# EAGLE design SparkFun WiFi Shield - DA16200 (EAGLE 9.6.2)
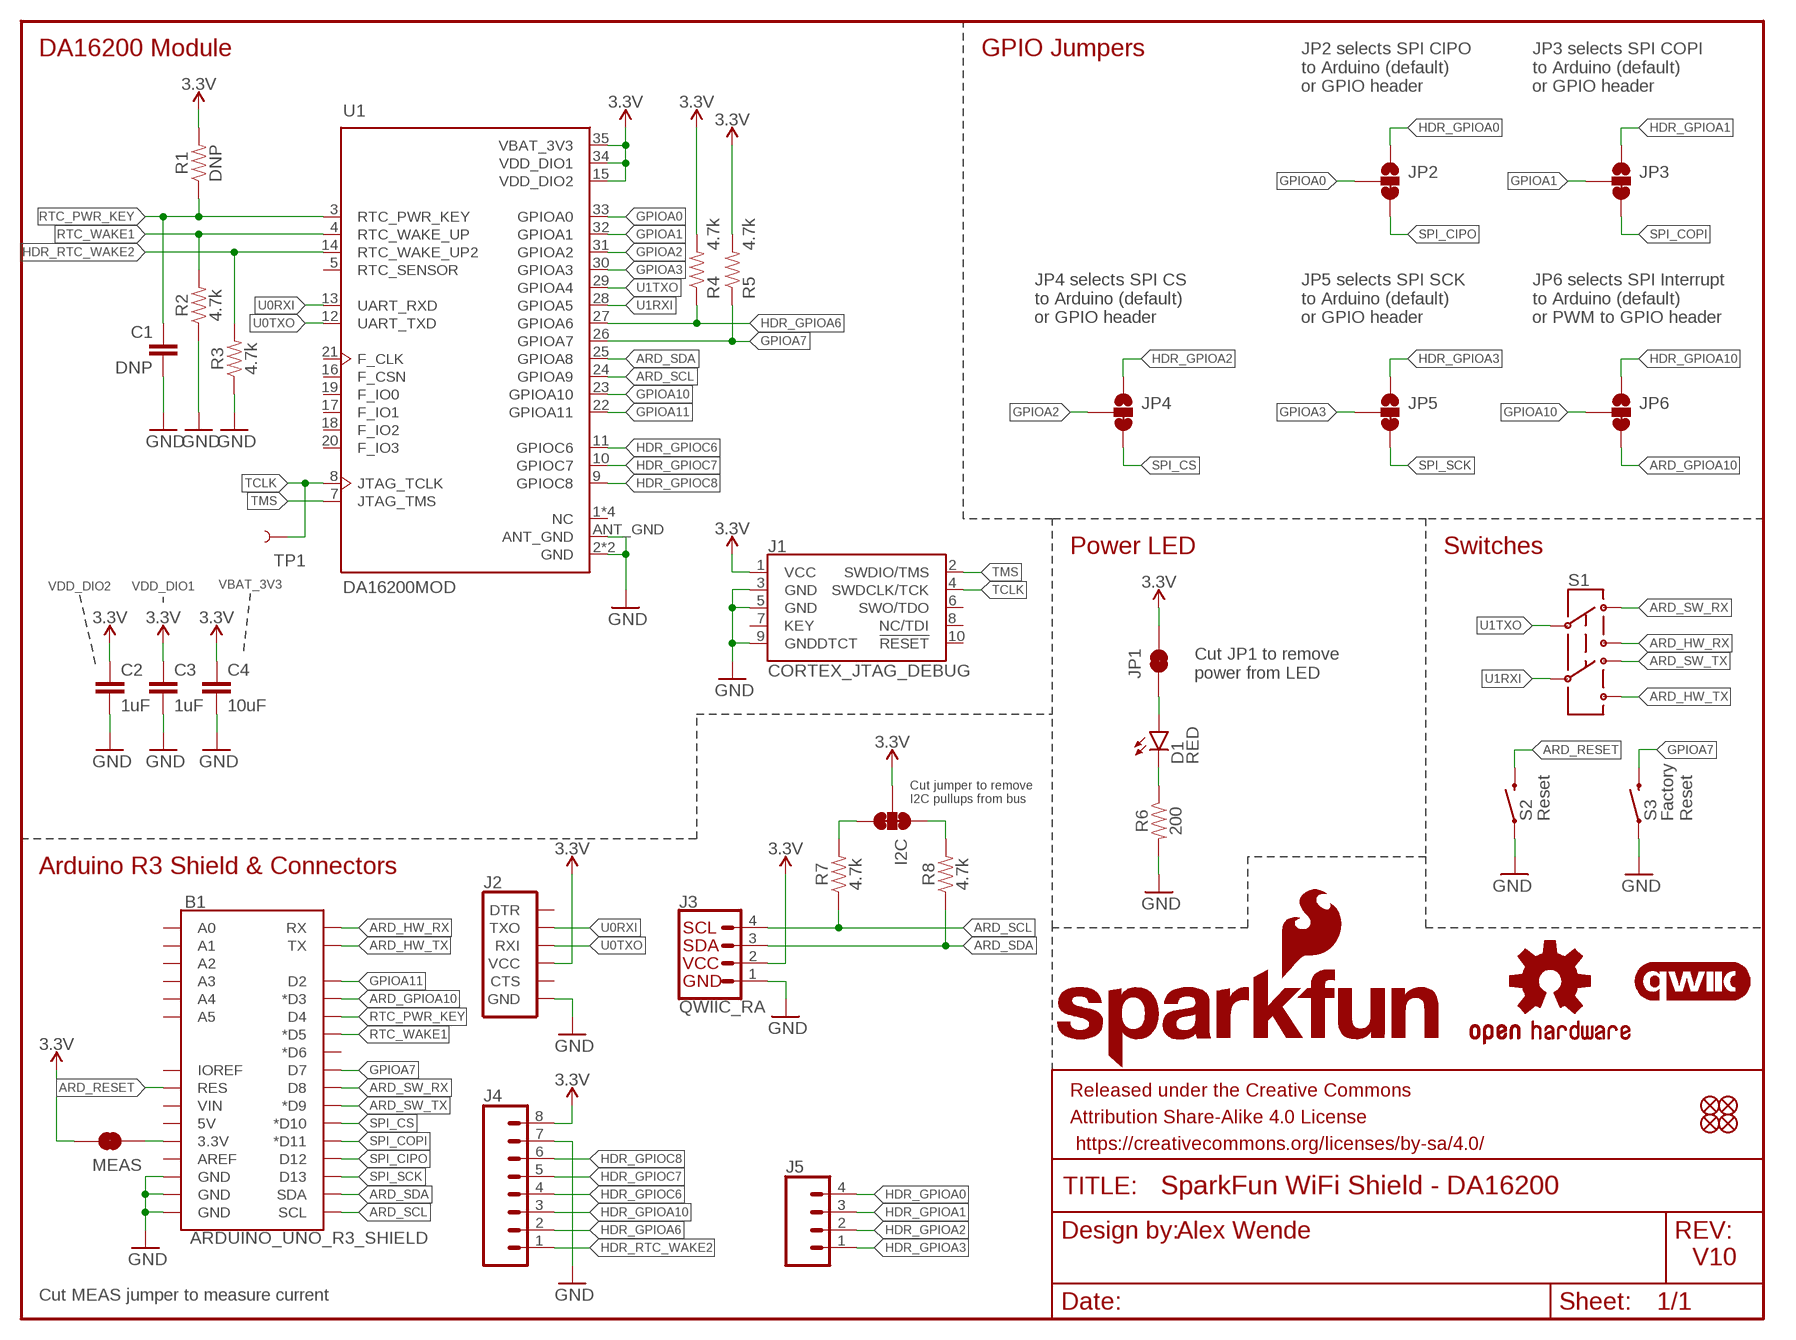
[diagram p0: schematic, sheet 1]

## Parts
B1  ARDUINO_UNO_R3_SHIELD  ARDUINO_UNO_R3_SHIELDUNO_R3_SHIELD_NOLABELS_LOCK  [UNO_R3_SHIELD_NOLABELS_LOCK]
C1  DNP  CAP-0603  [0603]
C2  1uF  1.0UF-0603-16V-10%  [0603]
C3  1uF  1.0UF-0603-16V-10%  [0603]
C4  10uF  10UF-0603-6.3V-20%  [0603]
D1  RED  LED-RED0603  [LED-0603]
FD1  FIDUCIAL1X2  [FIDUCIAL-1X2]
FD2  FIDUCIAL1X2  [FIDUCIAL-1X2]
FD3  FIDUCIAL1X2  [FIDUCIAL-1X2]
FD4  FIDUCIAL1X2  [FIDUCIAL-1X2]
FRAME1  FRAME-LETTER  [CREATIVE_COMMONS]
I2C  JUMPER-SMT_3_2-NC_TRACE_SILK  [SMT-JUMPER_3_2-NC_TRACE_SILK]
J1  CORTEX_JTAG_DEBUG  CORTEX_JTAG_DEBUG_PTH_NS  [2X5-PTH-1.27MM-NO_SILK]
J2  6_PIN_SERIAL_TARGET_NO_SILK  [1X06_NO_SILK]
J3  QWIIC_RA  QWIIC_CONNECTORJS-1MM  [JST04_1MM_RA]
J4  CONN_08NO_SILK_DNP  [1X08_NO_SILK]
J5  CONN_041X04_NO_SILK  [1X04_NO_SILK]
JP1  JUMPER-SMT_2_NC_TRACE_SILK  [SMT-JUMPER_2_NC_TRACE_SILK]
JP2  JUMPER-SMT_3_1-NC_TRACE_SILK  [SMT-JUMPER_3_1-NC_TRACE_SILK]
JP3  JUMPER-SMT_3_1-NC_TRACE_SILK  [SMT-JUMPER_3_1-NC_TRACE_SILK]
JP4  JUMPER-SMT_3_1-NC_TRACE_SILK  [SMT-JUMPER_3_1-NC_TRACE_SILK]
JP5  JUMPER-SMT_3_1-NC_TRACE_SILK  [SMT-JUMPER_3_1-NC_TRACE_SILK]
JP6  JUMPER-SMT_3_1-NC_TRACE_SILK  [SMT-JUMPER_3_1-NC_TRACE_SILK]
LOGO1  SFE_LOGO_NAME_FLAME.2_INCH  [SFE_LOGO_NAME_FLAME_.2]
LOGO2  OSHW-LOGOM  [OSHW-LOGO-M]
LOGO4  QWIIC_LOGO_5MM  [QWIIC_5MM]
MEAS  JUMPER-COMBO_2_NC_TRACE  [COMBO-JUMPER_2_NC_TRACE]
R1  DNP  RESISTOR0603  [0603]
R2  4.7k  4.7KOHM-0603-1/10W-1%  [0603]
R3  4.7k  4.7KOHM-0603-1/10W-1%  [0603]
R4  4.7k  4.7KOHM-0603-1/10W-1%  [0603]
R5  4.7k  4.7KOHM-0603-1/10W-1%  [0603]
R6  200  200OHM-0603-1/10W-1%  [0603]
R7  4.7k  4.7KOHM-0603-1/10W-1%  [0603]
R8  4.7k  4.7KOHM-0603-1/10W-1%  [0603]
S1  DPDT  SWITCH-DPDT-SMD-AYZ0202  [SWITCH_DPDT_SMD_AYZ0202]
S2  Reset  MOMENTARY-SWITCH-SPST-SMD-5.2MM-TALL  [TACTILE_SWITCH_SMD_5.2MM]
S3  MOMENTARY-SWITCH-SPST-SMD-5.2MM-TALL  [TACTILE_SWITCH_SMD_5.2MM]
TP1  TEST-POINT3  [PAD.03X.03]
U1  DA16200MOD  DA16200MOD-AAC4WA32  [XCVR_DA16200MOD-AAC4WA32]

## Nets
3.3V: C2.1 C3.1 C4.1 I2C.2 J1.1(VCC) J2.4(VCC) J3.2 J4.8 JP1.2 MEAS.1 MEAS.3 R1.2 R4.2 R5.2 U1.15(VDD_DIO2) U1.34(VDD_DIO1) U1.35(VBAT_3V3)
ARD_GPIOA10: B1.D3(*D3) JP6.3
ARD_HW_RX: B1.RX S1.1
ARD_HW_TX: B1.TX S1.4
ARD_RESET: B1.RES S2.3
ARD_SCL: B1.SCL J3.4 R7.1 U1.24(GPIOA9)
ARD_SDA: B1.SDA J3.3 R8.1 U1.25(GPIOA8)
ARD_SW_RX: B1.D8 S1.3
ARD_SW_TX: B1.D9(*D9) S1.6
GND: B1.GND@0(GND) B1.GND@1(GND) B1.GND@2(GND) C1.2 C2.2 C3.2 C4.2 J1.3(GND) J1.5(GND) J1.9(GNDDTCT) J2.6(GND) J3.1 J4.7 R2.1 R3.1 R6.2 S2.1 S3.1 U1.2(GND) U1.ANT_GND U1.GND
GPIOA0: JP2.2 U1.33(GPIOA0)
GPIOA1: JP3.2 U1.32(GPIOA1)
GPIOA2: JP4.2 U1.31(GPIOA2)
GPIOA3: JP5.2 U1.30(GPIOA3)
GPIOA7: B1.D7 R5.1 S3.3 U1.26(GPIOA7)
GPIOA10: JP6.2 U1.23(GPIOA10)
GPIOA11: B1.D2 U1.22(GPIOA11)
HDR_GPIOA0: J5.4 JP2.1
HDR_GPIOA1: J5.3 JP3.1
HDR_GPIOA2: J5.2 JP4.1
HDR_GPIOA3: J5.1 JP5.1
HDR_GPIOA6: J4.2 R4.1 U1.27(GPIOA6)
HDR_GPIOA10: J4.3 JP6.1
HDR_GPIOC6: J4.4 U1.11(GPIOC6)
HDR_GPIOC7: J4.5 U1.10(GPIOC7)
HDR_GPIOC8: J4.6 U1.9(GPIOC8)
HDR_RTC_WAKE2: J4.1 R3.2 U1.14(RTC_WAKE_UP2)
N$1: B1.3.3V MEAS.2 MEAS.4
N$2: D1.A JP1.1
N$3: I2C.3 R7.2
N$4: I2C.1 R8.2
N$5: D1.C R6.1
RTC_PWR_KEY: B1.D4 C1.1 R1.1 U1.3(RTC_PWR_KEY)
RTC_WAKE1: B1.D5(*D5) R2.2 U1.4(RTC_WAKE_UP)
SPI_CIPO: B1.D12 JP2.3
SPI_COPI: B1.D11(*D11) JP3.3
SPI_CS: B1.D10(*D10) JP4.3
SPI_SCK: B1.D13 JP5.3
TCLK: J1.4(SWDCLK/TCK) TP1.1 U1.8(JTAG_TCLK)
TMS: J1.2(SWDIO/TMS) U1.7(JTAG_TMS)
U0RXI: J2.3(TXO) U1.13(UART_RXD)
U0TXO: J2.2(RXI) U1.12(UART_TXD)
U1RXI: S1.5 U1.28(GPIOA5)
U1TXO: S1.2 U1.29(GPIOA4)
Unconnected: B1.5V B1.A0 B1.A1 B1.A2 B1.A3 B1.A4 B1.A5 B1.AREF B1.D6(*D6) B1.IOREF B1.VIN J1.6(SWO/TDO) J1.7(KEY) J1.8(NC/TDI) J1.10(!RESET) J2.1(DTR) J2.5(CTS) U1.1(NC) U1.5(RTC_SENSOR) U1.6(NC) U1.16(F_CSN) U1.17(F_IO1) U1.18(F_IO2) U1.19(F_IO0) U1.20(F_IO3) U1.21(F_CLK) U1.36(NC) U1.37(NC)

## Notes on the sheet
- DA16200 Module | GPIO Jumpers
- JP2 selects SPI CIPO
  to Arduino (default) 
  or GPIO header
- JP3 selects SPI COPI
  to Arduino (default) 
  or GPIO header
- JP4 selects SPI CS
  to Arduino (default) 
  or GPIO header
- JP5 selects SPI SCK
  to Arduino (default) 
  or GPIO header
- JP6 selects SPI Interrupt
  to Arduino (default) 
  or PWM to GPIO header
- Power LED | Switches
- VDD_DIO2 | VDD_DIO1 | VBAT_3V3
- Cut JP1 to remove
  power from LED
- Cut jumper to remove
  I2C pullups from bus
- Factory
  Reset
- Arduino R3 Shield & Connectors
- Alex Wende
- V10
- Cut MEAS jumper to measure current

## Library data of the parts
B1 = SparkFun-Boards:ARDUINO_UNO_R3_SHIELD: Arduino R3 Shield Footprint Shield form compatible with the Arduino Uno R3. SparkFun Products: MG2639 Cellular Shield <https://www.sparkfun.com/products/13120> MIDI Shield <https://www.sparkfun.com/products/12898> R3 Stackable Headers Kit <https://www.sparkfun.com/products/11417>
C1 = SparkFun-Capacitors:CAP
C2 C3 = SparkFun-Capacitors:1.0UF: 1µF ceramic capacitors A capacitor is a passive two-terminal electrical component used to store electrical energy temporarily in an electric field.; PROD_ID: CAP-00868; VALUE: 1.0uF
C4 = SparkFun-Capacitors:10UF: 10.0µF ceramic capacitors A capacitor is a passive two-terminal electrical component used to store electrical energy temporarily in an electric field.; PROD_ID: CAP-11015
D1 = SparkFun-LED:LED-RED: Red SMD LED Used in manufacturing of most products at SparkFun Packages: 0603 - SMD 0603 package [Product Link] <http://docs.avagotech.com/docs/AV02-0551EN> 0603 SMART - SMD 0603 SMART package ( more efficient and expensive)[Product Link] <http://www.osram-os.com/Graphics/XPic2/00077099_0.pdf> 1206 - SMD1206 package [Product Link] <https://www.sparkfun.com/datasheets/DevTools/LilyPad/Q150OVS4.pdff> SparkFun Products: Pro Mini 328 -5V <https://www.sparkfun.com/products/821> RedBoard <https://www.sparkfun.com/products/12757> IOIO-OTG <https://www.sparkfun.com/products/13613>; PROD_ID: DIO-00819
FD1-FD4 = SparkFun-Aesthetics:FIDUCIAL: Fiducial Alignment Points Point-of-reference for pick-and-place machines and other optical instruments.
FRAME1 = SparkFun-Aesthetics:FRAME-LETTER: Schematic Frame - Letter Standard 8.5x11 US Letter frame
I2C = SparkFun-Jumpers:JUMPER-SMT_3_2-NC_TRACE: Normally closed trace jumper (2 of 2 connections) This jumper has a trace between all three pads so they are normally closed (NC). Use a razor knife to open the connection(s). For best results follow the IPC guidelines for cutting traces: Cutout at least 0.063 mm (0.005 in). Remove all loose material to clean up the cut area. Seal the cut with an approved epoxy. Reapply solder to reclose the connection(s).
J1 = SparkFun-Connectors:CORTEX_JTAG_DEBUG: Cortex Debug Connector - 10 pin Supports JTAG debug, Serial Wire debug, and Serial Wire Viewer. PTH and SMD connector options available. General Connector Information <http://infocenter.arm.com/help/topic/com.arm.doc.faqs/attached/13634/cortex_debug_connectors.pdf> Products: PTH Connector <http://www.digikey.com/product-detail/en/cnc-tech/3220-10-0100-00/1175-1627-ND/3883661> -via Digi-Key SparkFun PSoc <https://www.sparkfun.com/products/13229> SparkFun T <https://www.sparkfun.com/products/13810>
J2 = SparkFun-Connectors:6_PIN_SERIAL_TARGET: 6-pin header connection for use with the "FTDI BASIC" pinout - TARGET SIDE. Also known as "Arduino Serial Program Header". It is used to mate with our FTDI Basic serial programmers using the Arduino IDE. Note, this device has "TARGET" in the name. It is intended to be used on a design that contains a target micro-controller that you wish to program. The "sister" device, named "CABLE" is inteneded to be used on a design that usually lives on the end of your USB cable and prvides the converter chip (FTDI232 or FTDI231x) to commnicate serial RX/TX. You can populate with some of these: Break Away Headers - Straight <https://www.sparkfun.com/products/116> (PRT-00116) For reference (or to suit your programming needs) check out these designs: SparkFun FTDI Basic Breakout - 5V <https://www.sparkfun.com/products/9716> (DEV-09716) SparkFun FTDI Basic Breakout - 3.3V <https://www.sparkfun.com/products/9873> (DEV-09873) SparkFun FTDI SmartBasic <https://www.sparkfun.com/products/12935> (DEV-12935) SparkFun Beefy 3 - FTDI Basic Breakout <https://www.sparkfun.com/products/13746> (DEV-13746)
J3 = SparkFun-Connectors:QWIIC_CONNECTOR: SparkFun I2C Standard Qwiic Connector An SMD 1mm pitch JST connector makes it easy and quick (get it? Qwiic?) to connect I2C devices to each other. The Qwiic system <http://www.sparkfun.com/qwiic> enables fast and solderless connection between popular platforms and various sensors and actuators. We carry 200mm <https://www.sparkfun.com/products/14204>, 100mm <https://www.sparkfun.com/products/14205>, 50mm <https://www.sparkfun.com/products/14206>, and breadboard friendly <https://www.sparkfun.com/products/14207> Qwiic cables. We also offer 10 pcs strips <https://www.sparkfun.com/products/14323> the SMD connectors.; PROD_ID: CONN-13694; VALUE: QWIIC_RIGHT_ANGLE
J4 = SparkFun-Connectors:CONN_08: Multi connection point. Often used as Generic Header-pin footprint for 0.1 inch spaced/style header connections On any of the 0.1 inch spaced packages, you can populate with these: Break Away Headers - Straight <https://www.sparkfun.com/products/116> (PRT-00116) Break Away Male Headers - Right Angle <https://www.sparkfun.com/products/553> (PRT-00553) Female Headers <https://www.sparkfun.com/products/115> (PRT-00115) Break Away Headers - Machine Pin <https://www.sparkfun.com/products/117> (PRT-00117) Break Away Female Headers - Swiss Machine Pin <https://www.sparkfun.com/products/743> (PRT-00743) Arduino Stackable Header - 8 Pin <https://www.sparkfun.com/products/9279> (PRT-09279) For SCREWTERMINALS and SPRING TERMINALS visit here: Screw Terimnals on SparkFun.com <https://www.sparkfun.com/search/results?term=Screw+Terminals> (5mm/3.5mm/2.54mm spacing) This device is also useful as a general connection point to wire up your design to another part of your project. Our various solder wires solder well into these plated through hole pads. Hook-Up Wire - Assortment (Stranded, 22 AWG) <https://www.sparkfun.com/products/11375> (PRT-11375) Hook-Up Wire - Assortment (Solid Core, 22 AWG) <https://www.sparkfun.com/products/11367> (PRT-11367) View the entire wire category on our website here <https://www.sparkfun.com/categories/141> Special notes: Molex polarized connector foot print use with SKU : PRT-08231 with associated crimp pins and housings. 1MM SMD Version SKU: PRT-10208 NOTES ON THE VARIANTS LOCK and LOCK_LONGPADS... This footprint was designed to help hold the alignment of a through-hole component (i.e. 6-pin header) while soldering it into place. You may notice that each hole has been shifted either up or down by 0.005 of an inch from it's more standard position (which is a perfectly straight line). This slight alteration caused the pins (the squares in the middle) to touch the edges of the holes. Because they are alternating, it causes a "brace" to hold the component in place. 0.005 has proven to be the perfect amount of "off-center" position when using our standard breakaway headers. Although looks a little odd when you look at the bare footprint, once you have a header in there, the alteration is very hard to notice. Also,if you push a header all the way into place, it is covered up entirely on the bottom side.
J5 = SparkFun-Connectors:CONN_04: Multi connection point. Often used as Generic Header-pin footprint for 0.1 inch spaced/style header connections On any of the 0.1 inch spaced packages, you can populate with these: Break Away Headers - Straight <https://www.sparkfun.com/products/116> (PRT-00116) Break Away Male Headers - Right Angle <https://www.sparkfun.com/products/553> (PRT-00553) Female Headers <https://www.sparkfun.com/products/115> (PRT-00115) Break Away Headers - Machine Pin <https://www.sparkfun.com/products/117> (PRT-00117) Break Away Female Headers - Swiss Machine Pin <https://www.sparkfun.com/products/743> (PRT-00743) For SCREWTERMINALS and SPRING TERMINALS visit here: Screw Terimnals on SparkFun.com <https://www.sparkfun.com/search/results?term=Screw+Terminals> (5mm/3.5mm/2.54mm spacing) This device is also useful as a general connection point to wire up your design to another part of your project. Our various solder wires solder well into these plated through hole pads. Hook-Up Wire - Assortment (Stranded, 22 AWG) <https://www.sparkfun.com/products/11375> (PRT-11375) Hook-Up Wire - Assortment (Solid Core, 22 AWG) <https://www.sparkfun.com/products/11367> (PRT-11367) View the entire wire category on our website here <https://www.sparkfun.com/categories/141> Special notes: Molex polarized connector foot print use with SKU : PRT-08231 with associated crimp pins and housings. 1MM SMD Version SKU: PRT-10208; PROD_ID: CONN-09696
JP1 = SparkFun-Jumpers:JUMPER-SMT_2_NC_TRACE: Normally closed trace jumper This jumper has a trace between two pads so it's normally closed (NC). Use a razor knife to open the connection. For best results follow the IPC guidelines for cutting traces: Cutout at least 0.063 mm (0.005 in). Remove all loose material to clean up the cut area. Seal the cut with an approved epoxy. Reapply solder to reclose the connection.
JP2-JP6 = SparkFun-Jumpers:JUMPER-SMT_3_1-NC_TRACE: Normally closed trace jumper (1 of 2 connections) This jumper has a trace between two pads so it's normally closed (NC). The other connection is normally open (NO). Use a razor knife to open the connection. For best results follow the IPC guidelines for cutting traces: Cutout at least 0.063 mm (0.005 in). Remove all loose material to clean up the cut area. Seal the cut with an approved epoxy. Reapply solder to reclose the connection, or to close the NO connection.
LOGO1 = SparkFun-Aesthetics:SFE_LOGO_NAME_FLAME: SparkFun Font Logo w/ Flame This is the SparkFun full logo. The logo on the schematic will always be the same size; the package variant is the height of the flame part of the logo. Default layer for the logo on the board is tSilk.
LOGO2 = SparkFun-Aesthetics:OSHW-LOGO: Open-Source Hardware (OSHW) Logo This logo indicates the piece of hardware it is found on incorporates a OSHW license and/or adheres to the definition of open source hardware found here: http://freedomdefined.org/OSHW
LOGO4 = SparkFun-Aesthetics:QWIIC_LOGO: Qwiic Logos for placement on schematic and PCB. The 5.5mm silk logo is best for placing next to Qwiic connector.
MEAS = SparkFun-Jumpers:JUMPER-COMBO_2_NC_TRACE
R1 = SparkFun-Resistors:RESISTOR: Generic Resistor Package
R2-R5 R7 R8 = SparkFun-Resistors:4.7KOHM: 4.7kΩ resistor A resistor is a passive two-terminal electrical component that implements electrical resistance as a circuit element. Resistors act to reduce current flow, and, at the same time, act to lower voltage levels within circuits. - Wikipedia; PROD_ID: RES-07857
R6 = SparkFun-Resistors:200OHM: 200Ω resistor A resistor is a passive two-terminal electrical component that implements electrical resistance as a circuit element. Resistors act to reduce current flow, and, at the same time, act to lower voltage levels within circuits. - Wikipedia; PROD_ID: RES-08220
S1 = SparkFun-Switches:SWITCH-DPDT: Double-Pole, Double-Throw (DPDT) Switch Double-pole, double-throw switches. Variant Overview PTH-GPI-152-3013 Used on SparkFun Geiger Counter <https://www.sparkfun.com/products/11345> SMD-AY0202 Surface Mount DPDT Switch <https://www.sparkfun.com/products/597> (COM-00597) Used on e.g. LilyPad Arduino USB - ATmega32U4 Board <https://www.sparkfun.com/products/12049>; PROD_ID: SWCH-08179; SF_SKU: COM-00597
S2 S3 = SparkFun-Switches:MOMENTARY-SWITCH-SPST: Momentary Switch (Pushbutton) - SPST Normally-open (NO) SPST momentary switches (buttons, pushbuttons). Variants PTH-12MM - 12mm square, through-hole Momentary Pushbutton Switch - 12mm Square <https://www.sparkfun.com/products/9190> (COM-09190) PTH-6.0MM, PTH-6.0MM-KIT - 6.0mm square, through-hole Mini Pushbutton Switch <https://www.sparkfun.com/products/97> (COM-00097) KIT package intended for soldering kit's - only one side of pads' copper is exposed. PTH-RIGHT-ANGLE-KIT - Right-angle, through-hole Right Angle Tactile Button <https://www.sparkfun.com/products/10791> - Used on SparkFun BigTime Watch Kit <https://www.sparkfun.com/products/11734> SMD-12MM - 12mm square, surface-mount Tactile Button - SMD (12mm) <https://www.sparkfun.com/products/12993> (COM-12993) Used on SparkFun PicoBoard <https://www.sparkfun.com/products/11888> SMD-4.5MM - 4.5mm Square Trackball Switch Used on SparkFun Blackberry Trackballer Breakout <https://www.sparkfun.com/products/13169> SMD-4.6MMX2.8MM - 4.60mm x 2.80mm, surface mount Used on SparkFun Pro Micro - RP2040 <https://www.sparkfun.com/products/17717> SMD-5.2MM, SMD-5.2-REDUNDANT - 5.2mm square, surface-mount Mini Pushbutton Switch - SMD <https://www.sparkfun.com/products/8720> (COM-08720) Used on Arduino Pro Mini <https://www.sparkfun.com/products/11114> REDUNDANT package connects both switch circuits together SMD-6.0X3.5MM - 6.0 x 3.5mm, surface mount Momentary Reset Switch SMD <https://www.sparkfun.com/products/8229> (COM-08229) SMD-6.2MM-TALL - 6.2mm square, surface mount Tactile Button - SMD (6mm) <https://www.sparkfun.com/products/12992> Used on SparkFun Digital Sandbox <https://www.sparkfun.com/products/12651> SMD-RIGHT-ANGLE - Right-angle, surface mount Used on SparkFun Block for Intel® Edison - Arduino <https://www.sparkfun.com/products/13036>; PROD_ID: SWCH-14139
TP1 = SparkFun-Connectors:TEST-POINT: SparkFun Test Points Bare copper test points for troubleshooting or In-Circuit-Testing. These are used by our Production team for verifying production board runs using pogo-pins on test beds. SparkFun Products: SparkFun LSM9DS1 Breakout <https://www.sparkfun.com/products/13284> SparkFun PSOC <https://www.sparkfun.com/products/13714> SparkFun Load Cell Amplifier <https://www.sparkfun.com/products/13879>
U1 = DA16200MOD:DA16200MOD-AAC4WA32: Check prices <https://pricing.snapeda.com/parts/DA16200MOD-AAC4WA32/Dialog%20Semiconductor%20GmbH/view-part?ref=eda>; PROD_ID: IC-16179

## Board
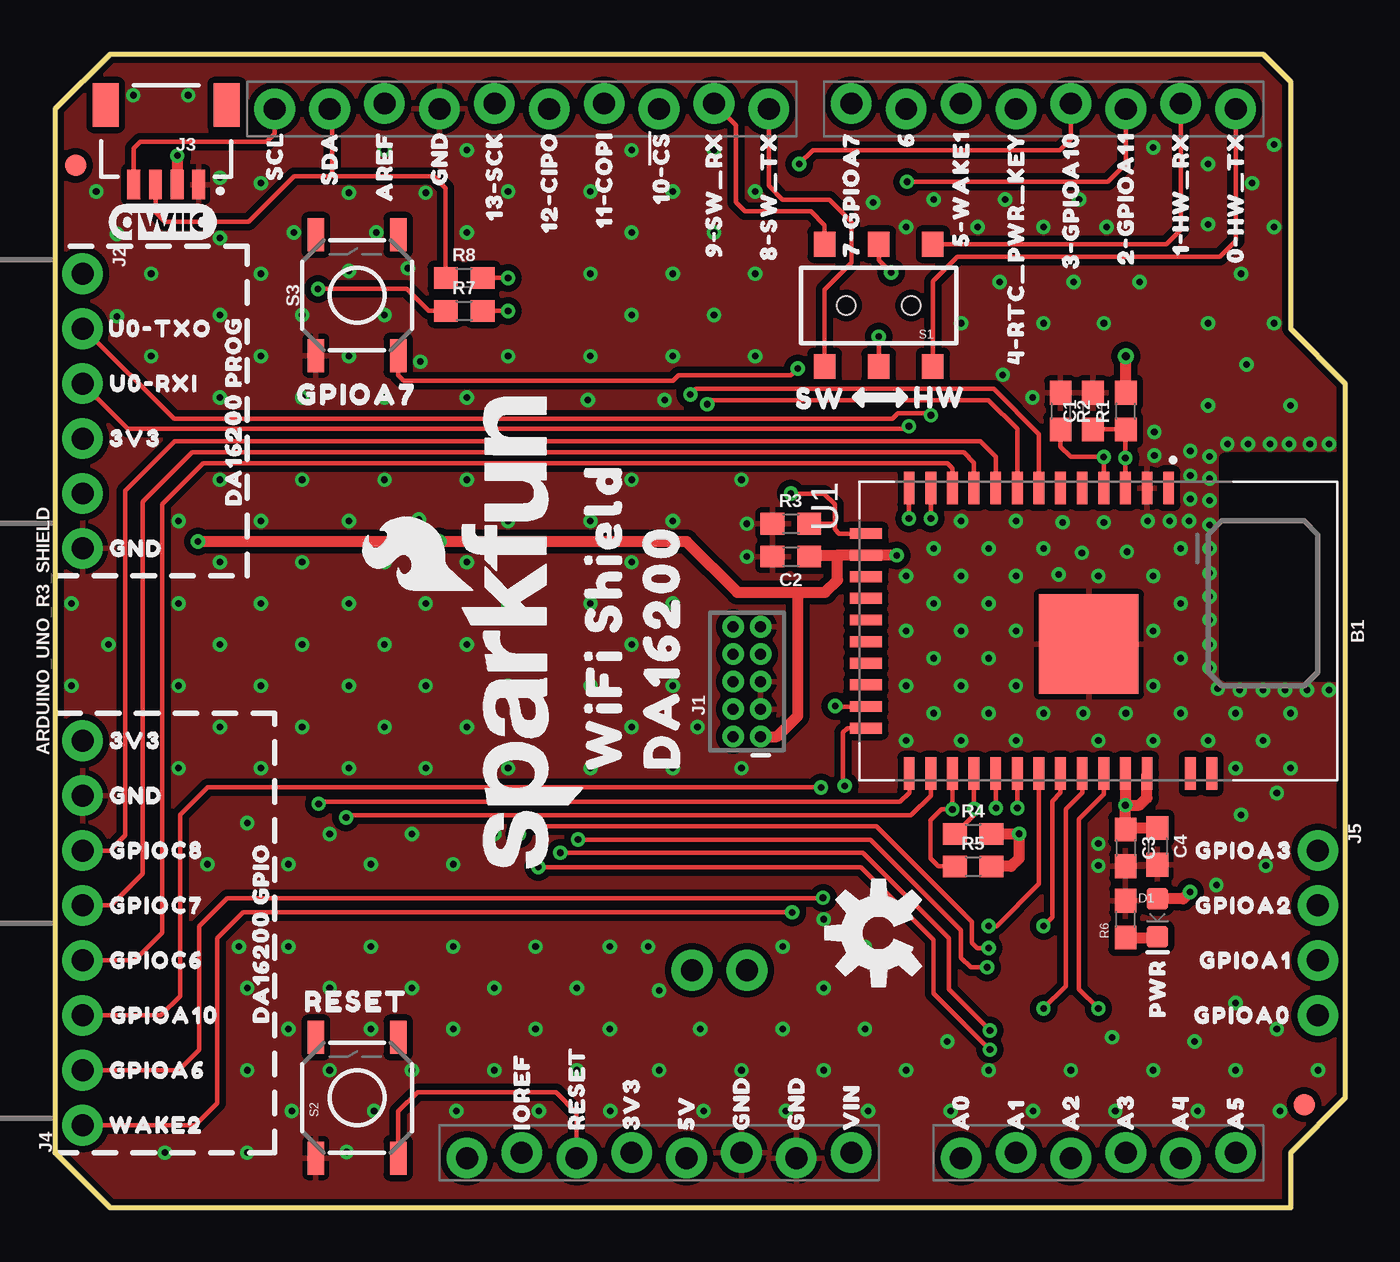
[diagram p1: board, top side]
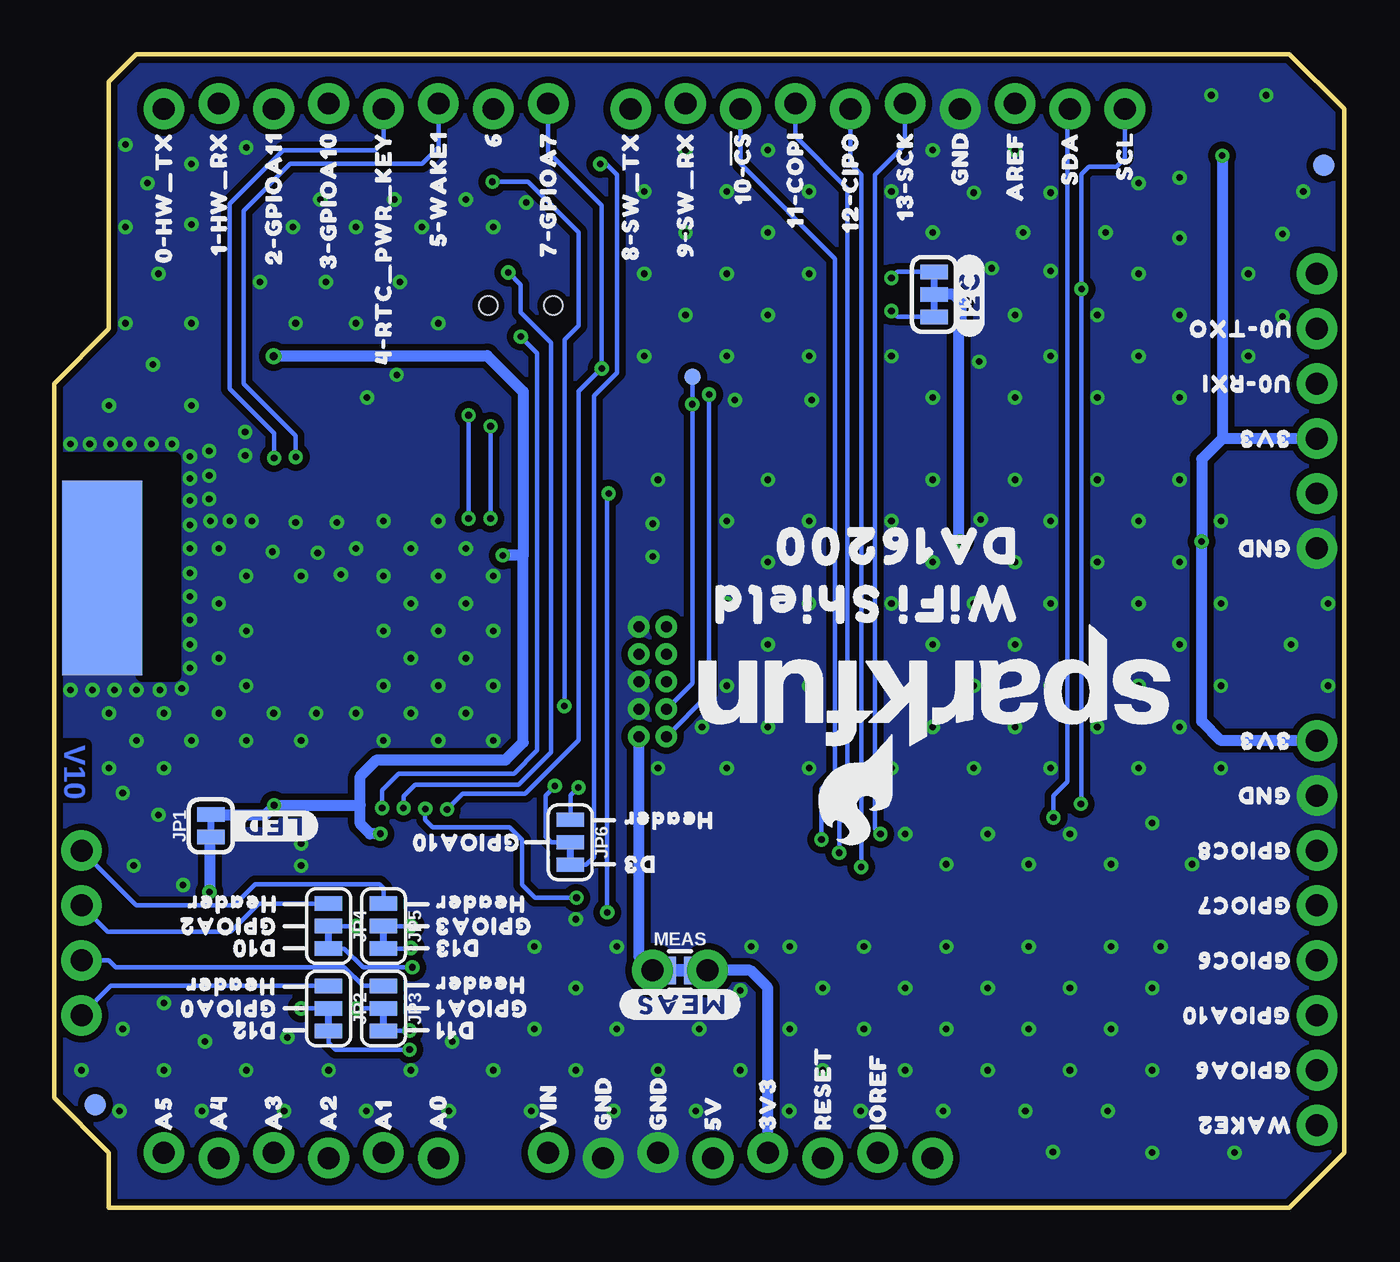
[diagram p2: board, bottom side, seen from below]

Size 59.69 x 53.34 mm. Coordinates in mm from the lower left corner, seen from the top.
Outline: 0,50.8 0,2.54 2.54,0 57.15,0 57.15,2.54 59.69,5.08 59.69,38.1 57.15,40.64 57.15,52.07 55.88,53.34 2.54,53.34 0,50.8
Copper layers (1*16): Top 0.035mm / dielectric 1.5mm / Bottom 0.035mm
Design rules "SparkFun-2-Layer-General-JLCPCB": minimum track width 7mil, minimum drill 0.3mm, track to track 7mil, track to pad 7mil, pad to pad 7mil, via to via 7mil, smd to smd 7mil, copper to edge 7mil, drill to drill 7mil, minimum pad ring 7mil, minimum via ring 7mil, stop-mask expansion 3mil, vias tented up to drill 25mil, thermal gap 10mil

### Footprints (pad centres in the part's own frame; a part is rotated, then mirrored left to right if it is on the bottom)
UNO_R3_SHIELD_NOLABELS_LOCK = drill 1.016 pad 1.88: 3.3V 24.13,-3.81; 5V 24.384,-1.27; A0 24.384,11.43; A1 24.13,13.97; A2 24.384,16.51; A3 24.13,19.05; A4 24.384,21.59; A5 24.13,24.13; AREF -24.384,-15.24; D2 -24.13,19.05; D3 -24.384,16.51; D4 -24.13,13.97; D5 -24.384,11.43; D6 -24.13,8.89; D7 -24.384,6.35; D8 -24.13,2.54; D9 -24.384,0; D10 -24.13,-2.54; D11 -24.384,-5.08; D12 -24.13,-7.62; D13 -24.384,-10.16; GND@0 24.13,1.27; GND@1 24.384,3.81; GND@2 -24.13,-12.7; IOREF 24.13,-8.89; NC 24.384,-11.43; RES 24.384,-6.35; RX -24.13,24.13; SCL -24.13,-20.32; SDA -24.13,-17.78; TX -24.384,21.59; VIN 24.13,6.35
0603 = smd 1.1 x 1: 1 -0.85,0; 2 0.85,0
LED-0603 = smd 1 x 1: A -0.877,0; C 0.877,0
FIDUCIAL-1X2 = smd 1 x 1: 1 0,0
SMT-JUMPER_3_2-NC_TRACE_SILK = smd 0.66 x 1.27: 1 -1.041,0; 2 0,0; 3 1.041,0
2X5-PTH-1.27MM-NO_SILK = drill 0.508 pad 1: 1 -2.54,-0.635; 2 -2.54,0.635; 3 -1.27,-0.635; 4 -1.27,0.635; 5 0,-0.635; 6 0,0.635; 7 1.27,-0.635; 8 1.27,0.635; 9 2.54,-0.635; 10 2.54,0.635
1X06_NO_SILK = drill 1.016 pad 1.88: 1 0,0; 2 2.54,0; 3 5.08,0; 4 7.62,0; 5 10.16,0; 6 12.7,0
JST04_1MM_RA = smd 0.6 x 1.35: 1 -1.5,0; 2 -0.5,0; 3 0.5,0; 4 1.5,0 | smd 1.2 x 2: NC1 2.8,-3.675; NC2 -2.8,-3.675
1X08_NO_SILK = drill 1.016 pad 1.88: 1 0,0; 2 2.54,0; 3 5.08,0; 4 7.62,0; 5 10.16,0; 6 12.7,0; 7 15.24,0; 8 17.78,0
1X04_NO_SILK = drill 1.016 pad 1.88: 1 0,0; 2 2.54,0; 3 5.08,0; 4 7.62,0
SMT-JUMPER_2_NC_TRACE_SILK = smd 0.66 x 1.27: 1 -0.521,0; 2 0.521,0
SMT-JUMPER_3_1-NC_TRACE_SILK = smd 0.66 x 1.27: 1 -1.041,0; 2 0,0; 3 1.041,0
COMBO-JUMPER_2_NC_TRACE = smd 0.635 x 1.27: 1 -0.508,0; 2 0.508,0 | drill 1.016 pad 1.88: 3 -1.27,0; 4 1.27,0
SWITCH_DPDT_SMD_AYZ0202 = smd 1 x 1.15: 1 -2.5,2.825; 2 0,2.825; 3 2.5,2.825; 4 -2.5,-2.825; 5 0,-2.825; 6 2.5,-2.825 | hole 0.85: 1.5,0; -1.5,0
TACTILE_SWITCH_SMD_5.2MM = smd 1.524 x 0.762: 1 -2.794,1.905; 2 2.794,1.905; 3 -2.794,-1.905; 4 2.794,-1.905
PAD.03X.03 = smd 0.762 x 0.762: 1 0,0
XCVR_DA16200MOD-AAC4WA32 = smd 1.5 x 0.5: 1 -6.6,3.25; 2 -6.6,2.25; 3 -6.6,1.25; 4 -6.6,0.25; 5 -6.6,-0.75; 6 -6.6,-1.75; 7 -6.6,-2.75; 8 -6.6,-3.75; 9 -6.6,-4.75; 10 -6.6,-5.75; 11 -6.6,-6.75; 12 -6.6,-7.75; 13 -6.6,-8.75; 24 6.6,-8.75; 25 6.6,-7.75; 26 6.6,-6.75; 27 6.6,-5.75; 28 6.6,-4.75; 29 6.6,-3.75; 30 6.6,-2.75; 31 6.6,-1.75; 32 6.6,-0.75; 33 6.6,0.25; 34 6.6,1.25; 35 6.6,2.25; 36 6.6,4.25; 37 6.6,5.25 | smd 0.5 x 1.5: 14 -4.5,-10.75; 15 -3.5,-10.75; 16 -2.5,-10.75; 17 -1.5,-10.75; 18 -0.5,-10.75; 19 0.5,-10.75; 20 1.5,-10.75; 21 2.5,-10.75; 22 3.5,-10.75; 23 4.5,-10.75 | smd 9 x 3.7 bottom: ANT_GND -2.45,9.2 | smd 4.6 x 4.6: GND 0.61,-0.45

### Placement (x,y rotation side)
B1  30.48,26.67 270 top
C1  48.01,36.83 90 top
C2  34.04,30.1 180 top
C3  49.52,16.64 270 top
C4  50.99,16.7 270 top
D1  50.99,13.4 270 top
FD1  0.95,48.2 0 top
FD2  0.95,48.2 0 bottom
FD3  57.78,4.76 0 top
FD4  57.78,4.76 0 bottom
FRAME1  -1.27,-20.32 0 top  (outside the outline)
I2C  18.99,42.23 270 bottom
J1  32,24.32 90 top
J2  1.27,43.18 270 top
J3  5.14,47.31 180 top
J4  1.27,3.81 90 top
J5  58.42,16.51 270 top
JP1  52.44,17.65 90 bottom
JP2  46.99,9.21 270 bottom
JP3  44.45,9.21 270 bottom
JP4  46.99,13.02 270 bottom
JP5  44.45,13.02 270 bottom
JP6  35.81,16.89 270 bottom
LOGO1  21.59,26.67 90 top
LOGO2  38.1,12.7 90 top
LOGO3  SFE_LOGO_NAME_FLAME.2_INCH  [SFE_LOGO_NAME_FLAME_.2]  19.05,24.13 180 bottom
LOGO4  4.95,45.59 0 top
MEAS  30.73,10.97 0 bottom
R1  49.53,36.83 90 top
R2  46.51,36.83 270 top
R3  34.04,31.62 0 top
R4  42.47,17.27 0 top
R5  42.47,15.77 0 top
R6  49.52,13.34 90 top
R7  18.92,41.47 0 top
R8  18.92,42.99 0 top
S1  38.1,41.72 180 top
S2  13.97,5.08 90 top
S3  13.97,42.19 90 top
TP1  30.16,38.42 0 bottom
U1  48.26,26.67 270 top
U$1  [IOREF0]  21.59,3.05 90 top
U$2  [RESET0]  24.13,3.05 90 top
U$3  [3V30]  26.67,3.05 90 top
U$4  [5V0]  29.21,3.05 90 top
U$5  [GND0]  31.75,3.05 90 top
U$6  [GND0]  34.29,3.05 90 top
U$7  [VIN0]  36.83,3.05 90 top
U$8  [A00]  41.91,3.05 90 top
U$9  [A10]  44.45,3.05 90 top
U$10  [A20]  46.99,3.05 90 top
U$11  [A30]  49.53,3.05 90 top
U$12  [A40]  52.07,3.05 90 top
U$13  [A50]  54.61,3.05 90 top
U$14  [0#HW_TX0]  54.61,50.29 90 top
U$15  [1#HW_RX0]  52.07,50.29 90 top
U$16  [IOREF0]  21.59,3.05 90 bottom
U$17  [GPIOA60]  1.97,6.35 0 top
U$18  [4#RTC_PWR_KEY0]  44.45,50.29 90 top
U$19  [RESET0]  24.13,3.05 90 bottom
U$20  [8#SW_TX0]  33.02,50.29 90 top
U$21  [7#GPIOA70]  36.83,50.29 90 top
U$23  [5#WAKE10]  41.91,50.36 90 top
U$24  [10##CS#0]  27.94,50.29 90 top
U$25  [11#COPI0]  25.4,50.29 90 top
U$26  [12#CIPO0]  22.86,50.29 90 top
U$27  [13#SCK0]  20.32,50.29 90 top
U$28  [GND0]  17.78,46.74 90 top
U$29  [AREF0]  15.24,50.29 90 top
U$30  [SDA0]  12.7,50.29 90 top
U$31  [SCL0]  10.16,50.29 90 top
U$32  [9#SW_RX0]  30.48,50.29 90 top
U$33  [5#WAKE10]  41.91,50.36 90 bottom
U$34  [GPIOA70]  13.97,37.59 0 top
U$35  [WAKE20]  1.97,3.81 0 top
U$36  [RESET_0]  14.1,9.53 0 top
U$37  [3V30]  1.97,35.56 0 top
U$38  [60]  39.37,50.29 90 top
U$39  [3V30]  26.67,3.05 90 bottom
U$40  [GND0]  1.97,19.05 0 top
U$41  [3V30]  1.97,21.59 0 top
U$42  [HW0]  42.86,37.47 0 top
U$43  [SW0]  37.27,37.4 0 top
U$44  [GPIOC80]  1.97,16.51 0 top
U$45  [GPIOC70]  1.97,13.97 0 top
U$46  [GPIOC60]  1.97,11.43 0 top
U$47  [GPIOA100]  8.13,8.89 0 top
U$48  [WAKE20]  1.97,3.81 180 bottom
U$49  [#I2C#0]  17.34,42.16 90 bottom
U$50  [2#GPIOA110]  49.53,50.29 90 bottom
U$51  [3#GPIOA100]  46.99,50.29 90 top
U$52  [GND0]  1.97,30.48 0 top
U$53  [U0#TXO0]  1.91,40.64 0 top
U$54  [U0#RXI0]  1.97,38.1 0 top
U$55  [5V0]  29.21,3.05 90 bottom
U$56  [GND0]  31.75,3.05 90 bottom
U$57  [GND0]  34.29,3.05 90 bottom
U$58  [VIN0]  36.83,3.05 90 bottom
U$59  [A00]  41.91,3.05 90 bottom
U$60  [A10]  44.45,3.05 90 bottom
U$61  [A20]  46.99,3.05 90 bottom
U$62  [A30]  49.53,3.05 90 bottom
U$63  [A40]  52.07,3.05 90 bottom
U$64  [A50]  54.61,3.05 90 bottom
U$65  [0#HW_TX0]  54.61,50.29 90 bottom
U$66  [1#HW_RX0]  52.07,50.29 90 bottom
U$68  [3#GPIOA100]  46.99,50.29 90 bottom
U$69  [GPIOA100]  43.75,16.89 180 bottom
U$70  [4#RTC_PWR_KEY0]  44.45,50.29 90 bottom
U$71  [60]  39.37,50.29 90 bottom
U$72  [7#GPIOA70]  36.83,50.29 90 bottom
U$73  [8#SW_TX0]  33.02,50.29 90 bottom
U$74  [9#SW_RX0]  30.48,50.29 90 bottom
U$75  [10##CS#0]  27.94,50.29 90 bottom
U$76  [11#COPI0]  25.4,50.29 90 bottom
U$77  [12#CIPO0]  22.86,50.29 90 bottom
U$78  [13#SCK0]  20.32,50.29 90 bottom
U$79  [GND0]  17.78,46.74 90 bottom
U$80  [AREF0]  15.24,50.29 90 bottom
U$81  [SDA0]  12.7,50.29 90 bottom
U$82  [SCL0]  10.16,50.29 90 bottom
U$83  [U0#TXO0]  1.91,40.64 180 bottom
U$84  [U0#RXI0]  1.97,38.1 180 bottom
U$85  [3V30]  1.97,35.56 180 bottom
U$86  [GND0]  1.97,30.48 180 bottom
U$87  [3V30]  1.97,21.59 180 bottom
U$88  [GND0]  1.97,19.05 180 bottom
U$89  [GPIOC80]  1.97,16.51 180 bottom
U$90  [GPIOC70]  1.97,13.97 180 bottom
U$91  [GPIOC60]  1.97,11.43 180 bottom
U$92  [GPIOA100]  8.13,8.89 180 bottom
U$93  [GPIOA00]  52.13,8.89 0 top
U$94  [GPIOA10]  52.39,11.43 0 top
U$95  [GPIOA60]  1.97,6.35 180 bottom
U$96  [D30]  33.97,15.88 180 bottom
U$97  [#LED#0]  51.69,17.65 180 bottom
U$98  [#MEAS#0]  30.73,9.4 180 bottom
U$99  [PWR0]  50.99,8.26 90 top
U$100  [WIFI_SHIELD0]  13.97,27.94 180 bottom
U$101  [DA162000]  13.97,30.61 180 bottom
U$102  [GPIOA20]  52.2,13.97 0 top
U$103  [GPIOA30]  52.2,16.51 0 top
U$104  [DA16200_GPIO0]  9.53,12.7 90 top
U$105  [DA16200_PROG0]  8.26,36.83 90 top
U$106  [HEADER0]  33.97,17.91 180 bottom
U$107  [WIFI_SHIELD0]  25.4,19.05 90 top
U$108  [DA162000]  28.07,19.05 90 top
U$109  [2#GPIOA110]  49.53,50.29 90 top
U$114  [GPIOA10]  37.27,9.21 180 bottom
U$115  [GPIOA00]  48.9,9.21 180 bottom
U$116  [GPIOA20]  48.9,13.02 180 bottom
U$117  [GPIOA30]  37.08,13.02 180 bottom
U$118  [HEADER0]  42.67,10.29 180 bottom
U$119  [HEADER0]  42.67,14.03 180 bottom
U$120  [HEADER0]  54.17,14.03 180 bottom
U$121  [HEADER0]  54.23,10.22 180 bottom
U$122  [D100]  48.9,12 180 bottom
U$123  [D110]  42.67,8.19 180 bottom
U$124  [D120]  48.9,8.19 180 bottom
U$125  [D130]  42.67,12 180 bottom

### Tracks (layer width: path | path; a pad name or v marks a point on that pad's centre or on a via)
3.3V  (via drill 0.3, 0.38)
  Top 0.508: 34.35,28.45 35.62,28.45 36.2,29.02 36.2,30.17 | U1.34 v49.51,18.61 | v38.92,30.16 U1.15 36.2,30.17 | C2.1 34.96,30.17 36.2,30.17 | J1.1 33.4,21.78 34.35,22.73 34.35,28.45 | v6.6,30.8 v17.78,30.8 29.21,30.8 31.56,28.45 34.35,28.45 | R5.2 44.22,15.77 44.59,16.14 v44.59,17.29 43.33,17.29 R4.2 | v49.51,18.61 50.16,18.61 50.51,18.95 U1.35 | R1.2 v49.53,39.37 | v5.65,48.64 v5.64,48.63 J3.2 | C4.1 49.58,17.55 C3.1 49.52,18.6 v49.51,18.61
  Bottom 0.508: JP1.2 49.9,18.17 49.51,18.56 v49.51,18.61 45.53,18.61 | J1.1 32.64,11.61 MEAS.3 MEAS.1 | v44.59,17.29 45.07,17.29 45.53,17.74 45.53,18.61 | 45.53,18.61 45.53,19.94 44.77,20.7 38.8,20.7 37.99,21.51 37.99,30.16 | I2C.2 18.1,42.23 17.72,41.85 17.72,40.58 17.84,40.45 17.84,30.86 v17.78,30.8 | 37.99,30.16 v38.92,30.16 | v49.53,39.37 49.51,39.4 39.65,39.4 37.99,37.73 37.99,30.16 | J2.4 5.65,35.56 | 5.65,35.56 6.6,34.61 v6.6,30.8 6.6,22.48 5.71,21.59 J4.8 | v5.65,48.64 5.65,35.56
ARD_GPIOA10  (via drill 0.3)
  Top 0.203: v34.42,48.26 35.05,48.9 46.48,48.9 46.99,49.4 B1.D3
  Bottom 0.203: v34.42,48.26 34.16,48.26 33.66,47.75 33.66,38.61 34.72,37.54 34.72,16.2 35.08,15.85 JP6.3
ARD_HW_RX
  Top 0.203: S1.1 40.6,42.83 41.74,43.97 53.88,43.97 54.61,44.7 B1.RX
ARD_HW_TX
  Top 0.203: S1.4 51.4,44.54 52.07,45.21 B1.TX
ARD_RESET
  Top 0.203: S2.3 15.88,4.45 16.76,5.33 23.16,5.33 24.13,4.37 B1.RES
ARD_SCL  (via drill 0.3)
  Top 0.203: U1.24 39.51,19.19 39.09,18.77 12.29,18.77 v12.19,18.67 | B1.SCL 10.16,49.66 9.78,49.28 3.94,49.28 3.64,48.98 J3.4 | R7.1 17.27,41.47 16.26,42.48 v12.17,42.48
  Bottom 0.203: v12.19,18.67 12.17,18.69 v12.17,42.48 12.17,47.78 11.81,48.13 10.54,48.13 10.16,48.51 B1.SCL
ARD_SDA  (via drill 0.3)
  Top 0.203: U1.25 40.51,19.05 39.6,18.14 13.56,18.14 v13.46,18.03 | 12.83,47.69 11.05,47.69 8.95,45.59 5.08,45.59 4.64,46.03 J3.3 | 12.83,47.69 12.83,50.8 B1.SDA | R8.1 18.07,47.14 17.53,47.69 12.83,47.69
  Bottom 0.203: B1.SDA 12.83,50.67 12.83,19.68 13.46,19.05 v13.46,18.03
ARD_SW_RX
  Top 0.203: S1.3 35.6,42.45 36.83,43.68 36.83,45.59 35.81,46.61 33.66,46.61 33.02,47.24 B1.D8
ARD_SW_TX
  Top 0.203: B1.D9 31.5,50.04 31.5,46.48 31.91,46.07 34.96,46.07 35.6,45.43 S1.6
GND  (via drill 0.3)
  other vias: 50.85,34.77 32,30.1 50.8,24.13 47.56,22.86 57.91,23.94 32,31.62 58.93,35.31 58.04,35.31 57.09,35.31 56.2,35.31 55.18,35.31 53.4,34.73 53.4,33.72 53.4,32.7 53.4,31.56 53.4,30.48 53.4,28.26 53.4,27.18 53.4,26.04 53.4,24.96 53.78,24 54.8,23.94 55.88,23.94 58.93,23.94 56.9,23.94 54.23,35.31 53.4,29.34 50.55,31.75 51.56,31.75 52.45,31.75 52.51,32.77 52.51,33.85 52.51,34.99 50.85,35.86 52.07,30.48 50.8,29.21 52.07,27.94 50.8,26.67 52.07,25.4 50.8,21.59 52.07,22.86 49.53,22.86 53.34,21.59 54.61,22.86 55.88,21.59 57.15,22.86 48.26,21.59 45.72,22.86 44.45,21.59 43.18,22.86 41.91,21.59 40.64,22.86 39.37,21.59 39.37,24.13 39.37,26.67 40.64,25.4 39.37,29.21 40.64,27.94 40.64,30.48 41.91,29.21 41.91,26.67 41.91,24.13 43.18,25.4 44.45,24.13 44.45,29.21 43.18,30.48 44.45,31.75 45.72,30.48 43.18,27.94 48.26,29.21 46.42,29.27 47.5,30.28 49.58,30.33 44.45,26.67 41.91,31.75 54.61,20.32 57.15,20.32 58.42,6.35 54.61,6.35 50.8,6.35 39.37,6.35 35.56,6.35 31.75,6.35 27.94,6.35 29.84,8.26 33.66,8.26 37.47,8.26 35.56,10.16 54.86,18.16 56.52,19.18 24.13,6.35 20.32,6.35 16.51,6.35 25.65,8.26 22.23,8.26 18.41,8.26 14.61,8.26 10.79,8.26 12.7,6.35 8.89,6.35 12.7,10.16 8.89,10.16 16.51,10.16 20.32,10.16 24.13,10.16 25.65,12.06 18.41,12.06 14.61,12.06 10.79,12.06 5.08,2.54 14.76,4.47 10.95,4.47 18.57,4.47 22.38,4.47 25.68,4.47 30,4.47 33.81,4.47 37.62,4.47 41.43,4.47 45.24,4.47 49.05,4.47 52.86,4.47 56.67,4.47 13.49,2.57 9.53,20.32 13.59,20.32 17.14,20.32 20.95,20.32 9.53,24.13 13.59,24.13 17.14,24.13 20.95,24.13 9.53,27.94 13.59,27.94 17.14,27.94 20.95,27.94 7.62,22.23 11.43,22.23 15.24,22.23 19.05,22.23 19.05,26.04 15.24,26.04 11.43,29.84 7.62,26.04 7.62,29.84 15.24,29.84 19.05,29.84 41.91,40.89 45.72,40.89 48.51,40.89 53.34,40.89 56.39,40.89 43.69,42.8 47.12,42.8 54.86,43.18 55.12,38.99 53.34,37.08 57.15,37.08 42.67,45.34 45.72,45.34 48.64,45.34 53.34,45.47 56.39,45.34 56.39,49.15 50.8,49.02 39.37,45.34 37.85,46.48 40.64,46.61 43.94,46.61 47.37,46.61 53.34,48.26 55.37,47.37 9.53,31.75 13.59,31.75 16.83,31.81 20.95,31.75 7.62,33.66 11.43,33.66 15.24,33.66 19.05,33.66 19.05,37.47 15.24,37.47 11.43,37.47 7.62,37.47 20.95,39.37 16.89,39.12 13.59,39.37 9.53,39.37 7.62,41.27 11.43,41.27 15.24,41.27 16.32,43.43 13.59,43.31 9.53,43.18 11.05,45.09 14.86,45.09 20.95,46.99 17.14,46.93 13.59,46.93 15.24,48.9 19.05,48.9 43.84,38.51 10.79,15.88 14.61,15.88 18.41,15.88 12.7,17.27 16.51,17.27 20.32,17.27 8.89,17.78 7.05,15.88 1.91,46.99 3.62,51.44 6.16,51.44 46.61,31.69 48.51,31.69 4.45,39.37 2.86,41.21 4.45,43.18 7.62,44.83 7.62,47.62 9.53,47.37 19.05,45.09 45.21,37.47 22.23,12.06 8.89,2.54 8.51,12.06 24.77,20.32 28.57,20.32 31.75,20.32 26.67,22.23 24.77,24.13 24.77,27.94 24.77,31.75 26.67,26.04 26.67,29.84 26.67,33.66 28.57,31.75 28.57,27.94 28.57,24.13 29.72,22.23 31.75,33.66 24.64,37.34 28.19,37.34 24.77,39.37 28.57,39.37 26.67,41.27 24.77,43.18 24.77,46.99 26.67,45.09 28.57,43.18 28.57,46.99 26.67,48.9 30.48,45.09 30.48,41.27 32.38,39.37 32.38,43.18 32.38,46.99 30.48,48.9 27.94,10.03 33.66,12.06 27.43,12.06 2.86,45.02 46.99,6.35 43.18,6.35 56.52,8.26 41.27,7.68 37.47,12.06 35.56,13.34 48.9,7.87 52.7,7.68 54.61,9.46 53.72,14.92 5.71,24.13 5.71,27.94 5.71,31.75 5.71,20.32 2.48,26.04 0.76,24.13 0.76,27.94 11.43,26.04 50.16,42.8 56.01,15.81 48.26,16.83 48.26,15.81
  pour Top (isolate 0.305): 0,0 0,53.34 59.69,53.34 59.69,0
  pour Bottom (isolate 0.305, no thermals): 0,0 0,53.34 59.69,53.34 59.69,0
GPIOA0  (via drill 0.3)
  Top 0.203: v48.26,9.21 47.37,10.1 47.37,17.97 48.51,19.11 U1.33
  Bottom 0.203: JP2.2 v48.26,9.21
GPIOA1  (via drill 0.3)
  Top 0.203: v45.72,9.21 46.75,10.24 46.75,18.42 47.51,19.18 U1.32
  Bottom 0.203: JP3.2 v45.72,9.21
GPIOA2  (via drill 0.3)
  Top 0.203: v45.72,13.02 46.13,13.43 46.13,18.8 46.51,19.18 U1.31
  Bottom 0.203: v45.72,13.02 JP4.2
GPIOA3  (via drill 0.3)
  Top 0.203: U1.30 45.51,14.97 43.56,13.02 v43.18,13.02
  Bottom 0.203: v43.18,13.02 JP5.2
GPIOA7  (via drill 0.3)
  Top 0.203: U1.26 v41.51,18.41 41,18.41 40.49,17.91 40.49,16.15 40.87,15.77 R5.1 | v34.35,38.8 34.04,38.48 28.83,38.48 28.57,38.23 16.13,38.23 15.88,38.48 S3.3
  Bottom 0.203: v41.51,18.41 40.8,19.13 37.9,19.13 35.42,21.6 35.42,37.76 34.38,38.8 v34.35,38.8 34.35,46.34 36.83,48.82 B1.D7
GPIOA10  (via drill 0.3)
  Top 0.203: U1.23 36.65,22.17 36.45,21.97 36.45,19.57 v36.52,19.5
  Bottom 0.203: v36.52,19.5 36.52,19.49 36.96,19.05 36.96,17.14 36.7,16.89 JP6.2
GPIOA11  (via drill 0.3)
  Top 0.203: U1.22 36.1,23.17 v36.08,23.19 | v39.41,47.43 48.7,47.43 49.53,48.26 B1.D2
  Bottom 0.203: v39.41,47.43 37.76,47.43 35.42,45.1 35.42,40.78 36.08,40.12 v36.08,23.19
HDR_GPIOA0
  Bottom 0.203: J5.4 57.06,10.25 JP2.1
HDR_GPIOA1
  Bottom 0.203: JP3.1 45.4,10.25 46.27,11.11 56.83,11.11 57.15,11.43 J5.3
HDR_GPIOA2
  Bottom 0.203: J5.2 57.21,12.76 51.52,12.76 50.23,14.06 JP4.1
HDR_GPIOA3
  Bottom 0.203: JP5.1 44.45,14.76 44.64,14.95 50.38,14.95 51.36,13.97 55.88,13.97 J5.1
HDR_GPIOA6  (via drill 0.3)
  Top 0.203: U1.27 v42.51,18.44 v42.52,18.44 42.52,18.17 R4.1 | v35.52,14.33 35.5,14.3 7.95,14.3 6.67,13.02 6.67,7.3 5.71,6.35 J4.2
  Bottom 0.203: v42.52,18.44 42.52,17.93 42.18,17.59 38.61,17.59 38.04,17.02 38.04,14.92 37.44,14.33 v35.52,14.33
HDR_GPIOA10  (via drill 0.3)
  Top 0.203: v35.43,19.43 7.05,19.43 5.78,18.16 5.78,9.78 4.89,8.89 J4.3
  Bottom 0.203: v35.43,19.43 35.79,19.07 35.79,17.96 JP6.1
HDR_GPIOC6
  Top 0.203: U1.11 41.51,34.18 41.27,34.42 6.86,34.42 4.95,32.51 4.95,12.7 3.68,11.43 J4.4
HDR_GPIOC7
  Top 0.203: U1.10 42.51,34.45 42.04,34.92 6.35,34.92 4.06,32.64 4.06,15.43 2.6,13.97 J4.5
HDR_GPIOC8
  Top 0.203: J4.6 2.54,16.51 3.24,17.21 3.24,33.15 5.52,35.43 42.8,35.43 43.51,34.72 U1.9
HDR_RTC_WAKE2  (via drill 0.3)
  Top 0.203: U1.14 36.27,31.17 36.07,31.37 36.07,31.62 | 36.07,31.62 36.07,32.51 35.56,33.02 v34.04,33.02 | R3.2 36.07,31.62 | J4.1 6.48,3.81 7.49,4.83 7.49,12.45 8.7,13.65 v34.1,13.65
  Bottom 0.203: v34.04,33.02 34.1,32.96 v34.1,13.65
N$1
  Bottom 0.508: B1.3.3V 26.67,10.16 27.48,10.97 MEAS.4 MEAS.2
N$2  (via drill 0.3)
  Top 0.508: v52.5,14.59 52.19,14.28 D1.A
  Bottom 0.508: JP1.1 52.5,17.07 v52.5,14.59
N$3  (via drill 0.3)
  Top 0.203: R7.2 v20.95,41.47
  Bottom 0.203: I2C.3 20.68,41.19 v20.95,41.47
N$4  (via drill 0.3)
  Top 0.203: R8.2 v20.95,42.99
  Bottom 0.203: v20.95,42.99 20.68,43.27 I2C.1
N$5
  Top 0.508: R6.1 50.95,12.48 D1.C
RTC_PWR_KEY  (via drill 0.3)
  Top 0.203: U1.3 v49.51,34.66 49.51,35.96 R1.1 C1.1
  Bottom 0.203: v49.51,34.66 49.51,35.8 51.56,37.85 51.56,46.42 49.09,48.9 44.83,48.9 44.45,49.28 B1.D4
RTC_WAKE1  (via drill 0.3)
  Top 0.203: U1.4 v48.51,34.71 46.99,34.71 46.51,35.19 R2.2
  Bottom 0.203: v48.51,34.71 48.51,35.68 50.93,38.1 50.93,46.1 48.77,48.26 42.67,48.26 41.91,49.02 B1.D5
SPI_CIPO  (via drill 0.3)
  Top 0.203: v43.24,7.3 40.64,9.91 40.64,12.38 37.27,15.75 v22.35,15.75
  Bottom 0.203: v22.35,15.75 22.35,47.75 22.86,48.26 B1.D12 | JP2.3 46.99,7.62 46.67,7.3 v43.24,7.3
SPI_COPI  (via drill 0.3)
  Top 0.203: v43.24,8.19 41.34,10.1 41.34,12.45 37.38,16.41 v23.37,16.41
  Bottom 0.203: B1.D11 25.4,49.53 22.99,47.12 22.99,19.84 23.37,19.46 v23.37,16.41 | JP3.3 43.27,8.17 v43.24,8.19
SPI_CS  (via drill 0.3)
  Top 0.203: v43.12,11.11 42.35,11.11 41.91,11.56 41.91,12.83 37.72,17.02 v24.19,17.02
  Bottom 0.203: B1.D10 27.94,48.26 23.56,43.88 23.56,20 24.19,19.37 v24.19,17.02 | JP4.3 46.27,11.98 45.4,11.11 v43.12,11.11
SPI_SCK  (via drill 0.3)
  Top 0.203: v43.18,12 42.67,12 42.42,12.26 42.42,13.21 38,17.63 21.82,17.63 v21.46,17.27
  Bottom 0.203: v21.46,17.27 21.72,17.53 21.72,47.75 20.32,49.15 B1.D13 | JP5.3 43.2,11.98 v43.18,12
TCLK  (via drill 0.3)
  Top 0.203: U1.8 44.51,36.01 43.18,37.34 30.35,37.34 v30.16,37.15
  Bottom 0.203: J1.4 30.16,24.26 v30.16,37.15 TP1.1
TMS  (via drill 0.3)
  Top 0.203: U1.7 45.51,35.77 43.42,37.86 29.64,37.86 v29.39,37.6
  Bottom 0.203: v29.39,37.6 29.39,23.76 J1.2
U0RXI  (via drill 0.3)
  Top 0.203: U1.13 39.5,33.26 v39.5,31.86 | v39.5,36.13 39.37,36.01 3.37,36.01 J2.3
  Bottom 0.203: v39.5,36.13 v39.5,31.86
U0TXO  (via drill 0.3)
  Top 0.203: U1.12 v40.51,31.86 | J2.2 1.33,40.64 5.5,36.47 38.72,36.47 38.99,36.74 40.38,36.74 40.49,36.64 v40.51,36.64
  Bottom 0.203: v40.51,36.64 v40.51,31.86
U1RXI  (via drill 0.3)
  Top 0.203: v38.67,43.24 38.1,43.81 S1.5 | U1.28 v43.51,18.48 v43.52,18.48
  Bottom 0.203: v43.52,18.48 43.52,19.02 42.99,19.56 38.19,19.56 36.69,21.06 36.69,25.7 36.7,25.72 36.7,40 38.1,41.4 38.1,42.67 v38.67,43.24
U1TXO  (via drill 0.3)
  Top 0.203: v38.1,40.27 S1.2 | U1.29 v44.51,18.48
  Bottom 0.203: v44.51,18.48 44.51,19.3 43.75,20.07 38.42,20.07 37.34,21.14 37.34,39.51 v38.1,40.27

### Text on the board
Bottom: V10
tDocu: Alex Wende